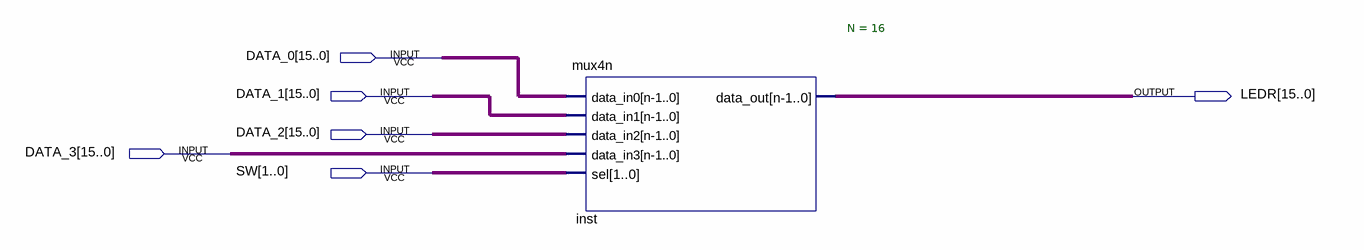
[diagram p0: schematic sheet]
// Quartus schematic test_mux4n.bdf as structural Verilog: 1 symbols, 6 pins
module test_mux4n (
  input  [15:0] DATA_0,
  input  [15:0] DATA_1,
  input  [15:0] DATA_2,
  input  [15:0] DATA_3,
  input  [1:0] SW,
  output [15:0] LEDR
);

  mux4n #(.N(16)) inst (
    .data_in0(DATA_0), .data_in1(DATA_1), .data_in2(DATA_2), .data_in3(DATA_3), .sel(SW), .data_out(LEDR));
endmodule
